# Altium schematic sheet USART2.SchDoc
size A4
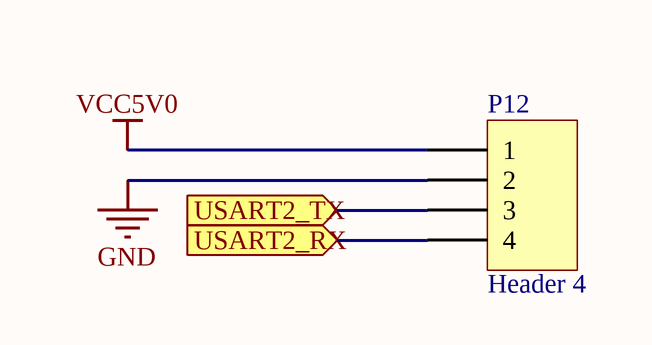
[diagram p0: USART2.SchDoc]

## Parts
P12  Header 4  [HDR1X4]

## Ports
USART2_RX, USART2_TX

## Nets
GND: P12.2
VCC5V0: P12.1
USART2_RX: P12.4 ; port USART2_RX
USART2_TX: P12.3 ; port USART2_TX

## Library data of the parts
P12 = Header 4: Header, 4-Pin; LatestRevisionDate: 17-Jul-2002; LatestRevisionNote: Re-released for DXP Platform.; Publisher: Altium Limited